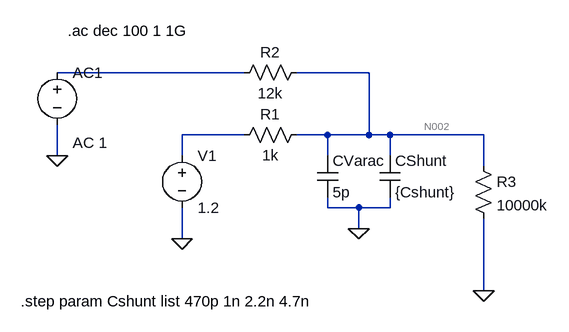
[diagram p0: schematic BypassCapTesting.asc]
BypassCapTesting.asc, the LTspice schematic file:
Version 4.1
SHEET 1 880 680
WIRE 96 144 -192 144
WIRE 288 144 176 144
WIRE 96 240 0 240
WIRE 224 240 176 240
WIRE 288 240 288 144
WIRE 288 240 224 240
WIRE 320 240 288 240
WIRE 464 240 320 240
WIRE -192 272 -192 224
WIRE 0 272 0 240
WIRE 224 272 224 240
WIRE 320 272 320 240
WIRE 464 288 464 240
WIRE 224 352 224 336
WIRE 272 352 224 352
WIRE 320 352 320 336
WIRE 320 352 272 352
WIRE 272 384 272 352
WIRE 0 400 0 352
WIRE 464 480 464 368
FLAG 272 384 0
FLAG 0 400 0
FLAG -192 272 0
FLAG 464 480 0
SYMBOL cap 208 272 R0
SYMATTR InstName CVarac
SYMATTR Value 5p
SYMBOL res 192 224 R90
WINDOW 0 0 56 VBottom 2
WINDOW 3 32 56 VTop 2
SYMATTR InstName R1
SYMATTR Value 1k
SYMBOL voltage 0 256 R0
WINDOW 123 0 0 Left 0
WINDOW 39 0 0 Left 0
SYMATTR InstName V1
SYMATTR Value 1.2
SYMBOL cap 304 272 R0
SYMATTR InstName CShunt
SYMATTR Value {Cshunt}
SYMBOL res 192 128 R90
WINDOW 0 0 56 VBottom 2
WINDOW 3 32 56 VTop 2
SYMATTR InstName R2
SYMATTR Value 12k
SYMBOL voltage -192 128 R0
WINDOW 123 24 124 Left 2
WINDOW 39 0 0 Left 0
SYMATTR InstName AC1
SYMATTR Value ""
SYMATTR Value2 AC 1
SYMBOL res 448 272 R0
SYMATTR InstName R3
SYMATTR Value 10000k
TEXT -176 80 Left 2 !.ac dec 100 1 1G
TEXT -248 496 Left 2 !.step param Cshunt list 470p 1n 2.2n 4.7n

The netlist it stands for:
* BypassCapTesting.asc
CVarac N002 0 5p
R1 N002 N003 1k
V1 N003 0 1.2
CShunt N002 0 {Cshunt}
R2 N002 N001 12k
V§AC1 N001 0 AC 1
R3 N002 0 10000k
.ac dec 100 1 1G
.step param Cshunt list 470p 1n 2.2n 4.7n
.backanno
.end

* Results of the author's LTspice run, read from the files saved beside the schematic
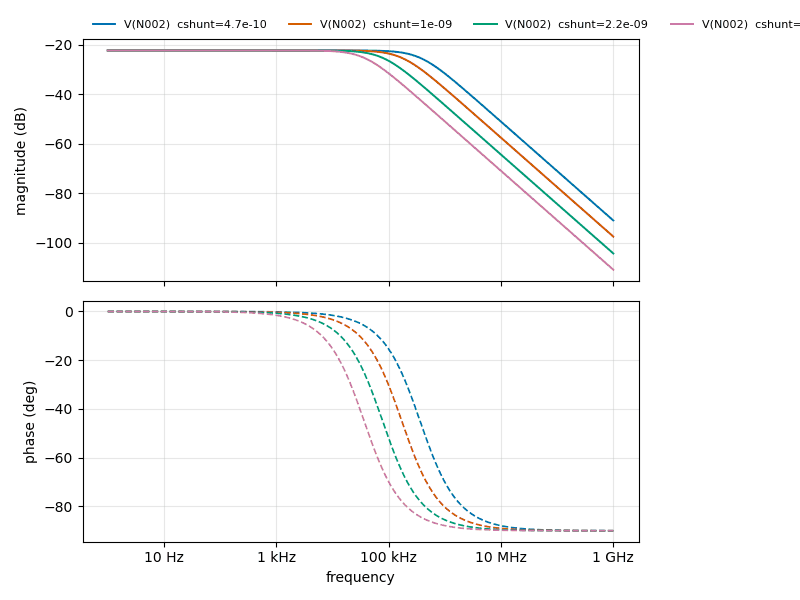
[diagram p1: AC Analysis of BypassCapTesting.asc, plotted from the saved traces]
* AC Analysis, 4 runs:
*   V(N002) [cshunt=4.7e-10]: -22.28 dB at 1 Hz, -91.08 dB at 1 GHz, peak -22.28 dB at 1 Hz, 3 dB below the peak at 363 kHz
*   V(N002) [cshunt=1e-09]: -22.28 dB at 1 Hz, -97.59 dB at 1 GHz, peak -22.28 dB at 1 Hz, 3 dB below the peak at 171.6 kHz
*   V(N002) [cshunt=2.2e-09]: -22.28 dB at 1 Hz, -104.42 dB at 1 GHz, peak -22.28 dB at 1 Hz, 3 dB below the peak at 78.2 kHz
*   V(N002) [cshunt=4.7e-09]: -22.28 dB at 1 Hz, -111.00 dB at 1 GHz, peak -22.28 dB at 1 Hz, 3 dB below the peak at 36.65 kHz